# EAGLE schematic lcd_booster-old (EAGLE 6.1)
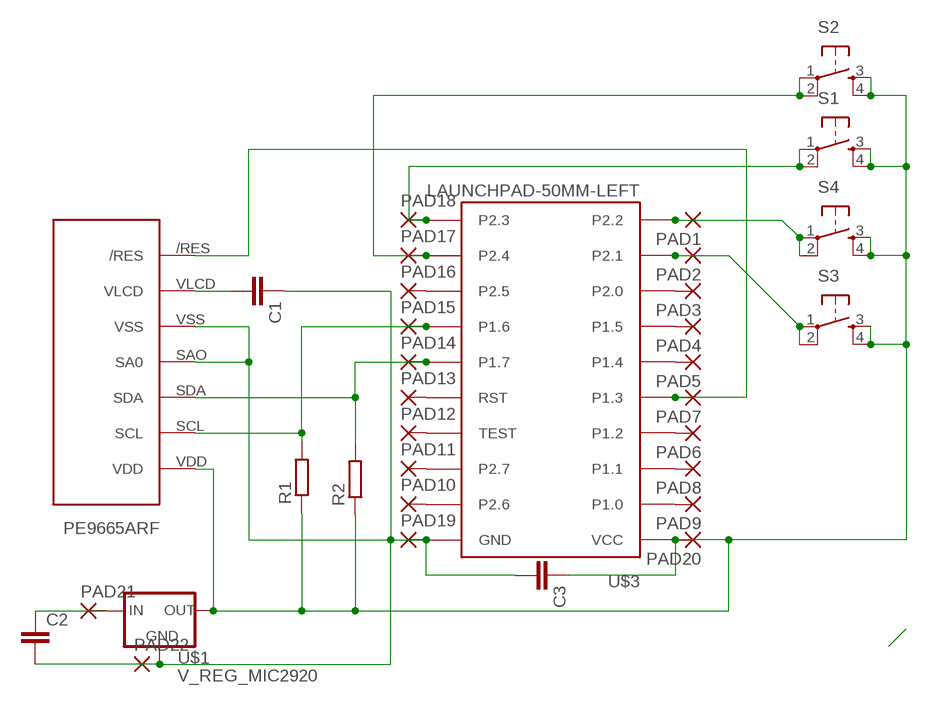
[diagram p0: schematic, sheet 1]

## Parts
C1  C-EUC1206  [C1206]
C2  C-EUC1206  [C1206]
C3  C-EUC1206  [C1206]
PAD1  1,6/0,9  [1,6/0,9]
PAD2  1,6/0,9  [1,6/0,9]
PAD3  1,6/0,9  [1,6/0,9]
PAD4  1,6/0,9  [1,6/0,9]
PAD5  1,6/0,9  [1,6/0,9]
PAD6  1,6/0,9  [1,6/0,9]
PAD7  1,6/0,9  [1,6/0,9]
PAD8  1,6/0,9  [1,6/0,9]
PAD9  1,6/0,9  [1,6/0,9]
PAD10  1,6/0,9  [1,6/0,9]
PAD11  1,6/0,9  [1,6/0,9]
PAD12  1,6/0,9  [1,6/0,9]
PAD13  1,6/0,9  [1,6/0,9]
PAD14  1,6/0,9  [1,6/0,9]
PAD15  1,6/0,9  [1,6/0,9]
PAD16  1,6/0,9  [1,6/0,9]
PAD17  1,6/0,9  [1,6/0,9]
PAD18  1,6/0,9  [1,6/0,9]
PAD19  1,6/0,9  [1,6/0,9]
PAD20  1,6/0,9  [1,6/0,9]
PAD21  1,6/0,9  [1,6/0,9]
PAD22  1,6/0,9  [1,6/0,9]
R1  R-EU_M1206  [M1206]
R2  R-EU_M1206  [M1206]
S1  TAC_SWITCHPTH  [TACTILE-PTH]
S2  TAC_SWITCHPTH  [TACTILE-PTH]
S3  TAC_SWITCHPTH  [TACTILE-PTH]
S4  TAC_SWITCHPTH  [TACTILE-PTH]
U$1  V_REG_MIC2920  [SOT223]
U$2  PE9665ARF  [PE9665ARF]
U$3  LAUNCHPAD-50MM-LEFT  [LAUNCHPAD-50MM-LEFT]

## Nets
N$1: PAD1.1(P) S4.1 S4.2 U$3.P2.2
N$2: PAD17.1(P) S2.1 S2.2 U$3.P2.4
N$3: PAD15.1(P) R1.2 U$2.SCL U$3.P1.6
N$4: PAD14.1(P) R2.2 U$2.SDA U$3.P1.7
N$5: C1.1 C2.2 C3.2 PAD19.1(P) PAD22.1(P) U$1.2(GND) U$2.SAO(SA0) U$2.VSS U$3.GND
N$6: C1.2 U$2.VLCD
N$7: PAD2.1(P) S3.1 S3.2 U$3.P2.1
N$8: PAD7.1(P) U$2./RES U$3.P1.3
N$9: PAD3.1(P) U$3.P2.0
N$10: PAD18.1(P) S1.1 S1.2 U$3.P2.3
N$11: PAD4.1(P) U$3.P1.5
N$13: PAD5.1(P) U$3.P1.4
N$14: PAD6.1(P) U$3.P1.2
N$15: PAD8.1(P) U$3.P1.1
N$16: PAD9.1(P) U$3.P1.0
N$17: PAD10.1(P) U$3.P2.6
N$18: PAD11.1(P) U$3.P2.7
N$19: PAD12.1(P) U$3.TEST
N$20: PAD13.1(P) U$3.RST
N$21: PAD16.1(P) U$3.P2.5
N$25: C3.1 PAD20.1(P) R1.1 R2.1 S1.3 S1.4 S2.3 S2.4 S3.3 S3.4 S4.3 S4.4 U$1.3(OUT) U$2.VDD U$3.VCC
N$28: C2.1 PAD21.1(P) U$1.1(IN)

## Library data of the parts
C1-C3 = rcl:C-EU: CAPACITOR, European symbol
PAD1-PAD22 = wirepad:1,6/0,9: THROUGH-HOLE PAD
R1 R2 = resistor:R-EU_: RESISTOR, European symbol
S1-S4 = SparkFun:TAC_SWITCH: Momentary Switch Button commonly used for reset or general input. Spark Fun Electronics SKU : COM-00097
U$1 = SparkFun:V_REG_MIC2920: MIC2920A (http://www.micrel.com/_PDF/mic2920.pdf) - 400mA output LDO Regulator
U$2 = apus:PE9665ARF
U$3 = TI_launchpad:LAUNCHPAD: MSP-EXP430G2 LaunchPad Booster Pack layouts. LAUNCHPAD: Full-size board LAUNCHPAD-50MM: 50x50mm board covering the button area LAUNCHPAD-50MM-LEFT: 50x50mm board leaving the button area open. Tall LaunchPad components marked on Reference for reference.